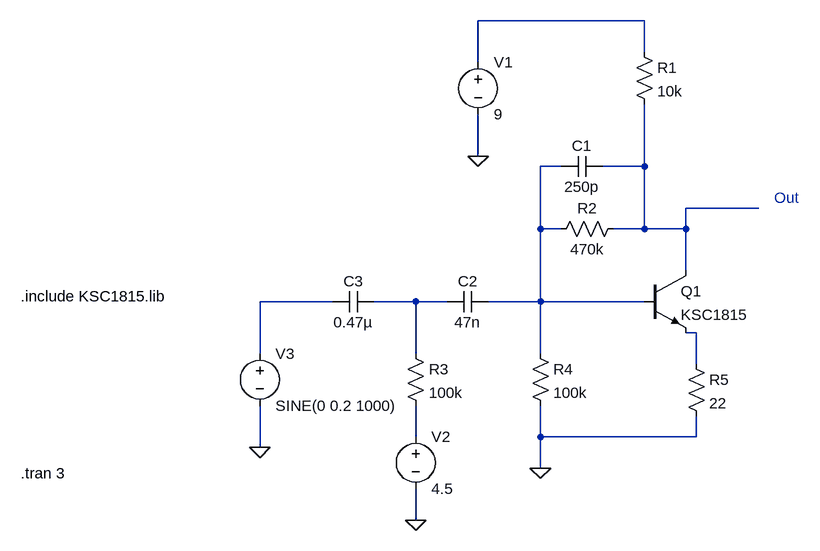
[diagram p0: schematic Transistor_booster.asc]
Transistor_booster.asc, the LTspice schematic file:
Version 4.1
SHEET 1 880 700
WIRE 288 -96 32 -96
WIRE 288 -48 288 -96
WIRE 32 -32 32 -96
WIRE 32 112 32 48
WIRE 160 128 128 128
WIRE 288 128 288 32
WIRE 288 128 224 128
WIRE 464 192 352 192
WIRE 128 224 128 128
WIRE 160 224 128 224
WIRE 288 224 288 128
WIRE 288 224 240 224
WIRE 352 224 352 192
WIRE 352 224 288 224
WIRE 352 288 352 224
WIRE -192 336 -304 336
WIRE -64 336 -128 336
WIRE -16 336 -64 336
WIRE 128 336 128 224
WIRE 128 336 48 336
WIRE 288 336 128 336
WIRE 368 384 352 384
WIRE -304 416 -304 336
WIRE -64 416 -64 336
WIRE 128 416 128 336
WIRE 368 432 368 384
WIRE -64 544 -64 496
WIRE 128 544 128 496
WIRE 368 544 368 512
WIRE 368 544 128 544
WIRE -304 560 -304 496
WIRE 128 592 128 544
WIRE -64 672 -64 624
FLAG 32 112 0
FLAG 128 592 0
FLAG -64 672 0
FLAG -304 560 0
SYMBOL voltage 32 -48 R0
WINDOW 123 0 0 Left 0
WINDOW 39 0 0 Left 0
SYMATTR InstName V1
SYMATTR Value 9
SYMBOL cap 224 112 R90
WINDOW 0 0 32 VBottom 2
WINDOW 3 32 32 VTop 2
SYMATTR InstName C1
SYMATTR Value 250p
SYMBOL res 272 -64 R0
SYMATTR InstName R1
SYMATTR Value 10k
SYMBOL res 256 208 R90
WINDOW 0 0 56 VBottom 2
WINDOW 3 32 56 VTop 2
SYMATTR InstName R2
SYMATTR Value 470k
SYMBOL cap 48 320 R90
WINDOW 0 0 32 VBottom 2
WINDOW 3 32 32 VTop 2
SYMATTR InstName C2
SYMATTR Value 47n
SYMBOL cap -128 320 R90
WINDOW 0 0 32 VBottom 2
WINDOW 3 32 32 VTop 2
SYMATTR InstName C3
SYMATTR Value 0.47µ
SYMBOL res -80 400 R0
SYMATTR InstName R3
SYMATTR Value 100k
SYMBOL res 112 400 R0
SYMATTR InstName R4
SYMATTR Value 100k
SYMBOL res 352 416 R0
SYMATTR InstName R5
SYMATTR Value 22
SYMBOL npn 288 288 R0
SYMATTR InstName Q1
SYMATTR Value KSC1815
SYMBOL voltage -64 528 R0
WINDOW 123 0 0 Left 0
WINDOW 39 0 0 Left 0
SYMATTR InstName V2
SYMATTR Value 4.5
SYMBOL voltage -304 400 R0
WINDOW 123 0 0 Left 0
WINDOW 39 0 0 Left 0
SYMATTR InstName V3
SYMATTR Value SINE(0 0.2 1000)
TEXT -672 328 Left 2 !.include KSC1815.lib
TEXT 488 176 Left 2 ;Out
TEXT -672 600 Left 2 !.tran 3

The netlist it stands for:
* Transistor_booster.asc
V1 N001 0 9
C1 N003 N002 250p
R1 N001 N003 10k
R2 N003 N002 470k
C2 N002 N005 47n
C3 N005 N004 0.47µ
R3 N005 N007 100k
R4 N002 0 100k
R5 N006 0 22
Q1 N003 N002 N006 0 KSC1815
V2 N007 0 4.5
V3 N004 0 SINE(0 0.2 1000)
.model NPN NPN
.model PNP PNP
.lib standard.bjt
.include KSC1815.lib
* Out
.tran 3
.backanno
.end